# EAGLE design MRCS-Optical-Detector (EAGLE 7.7.0)
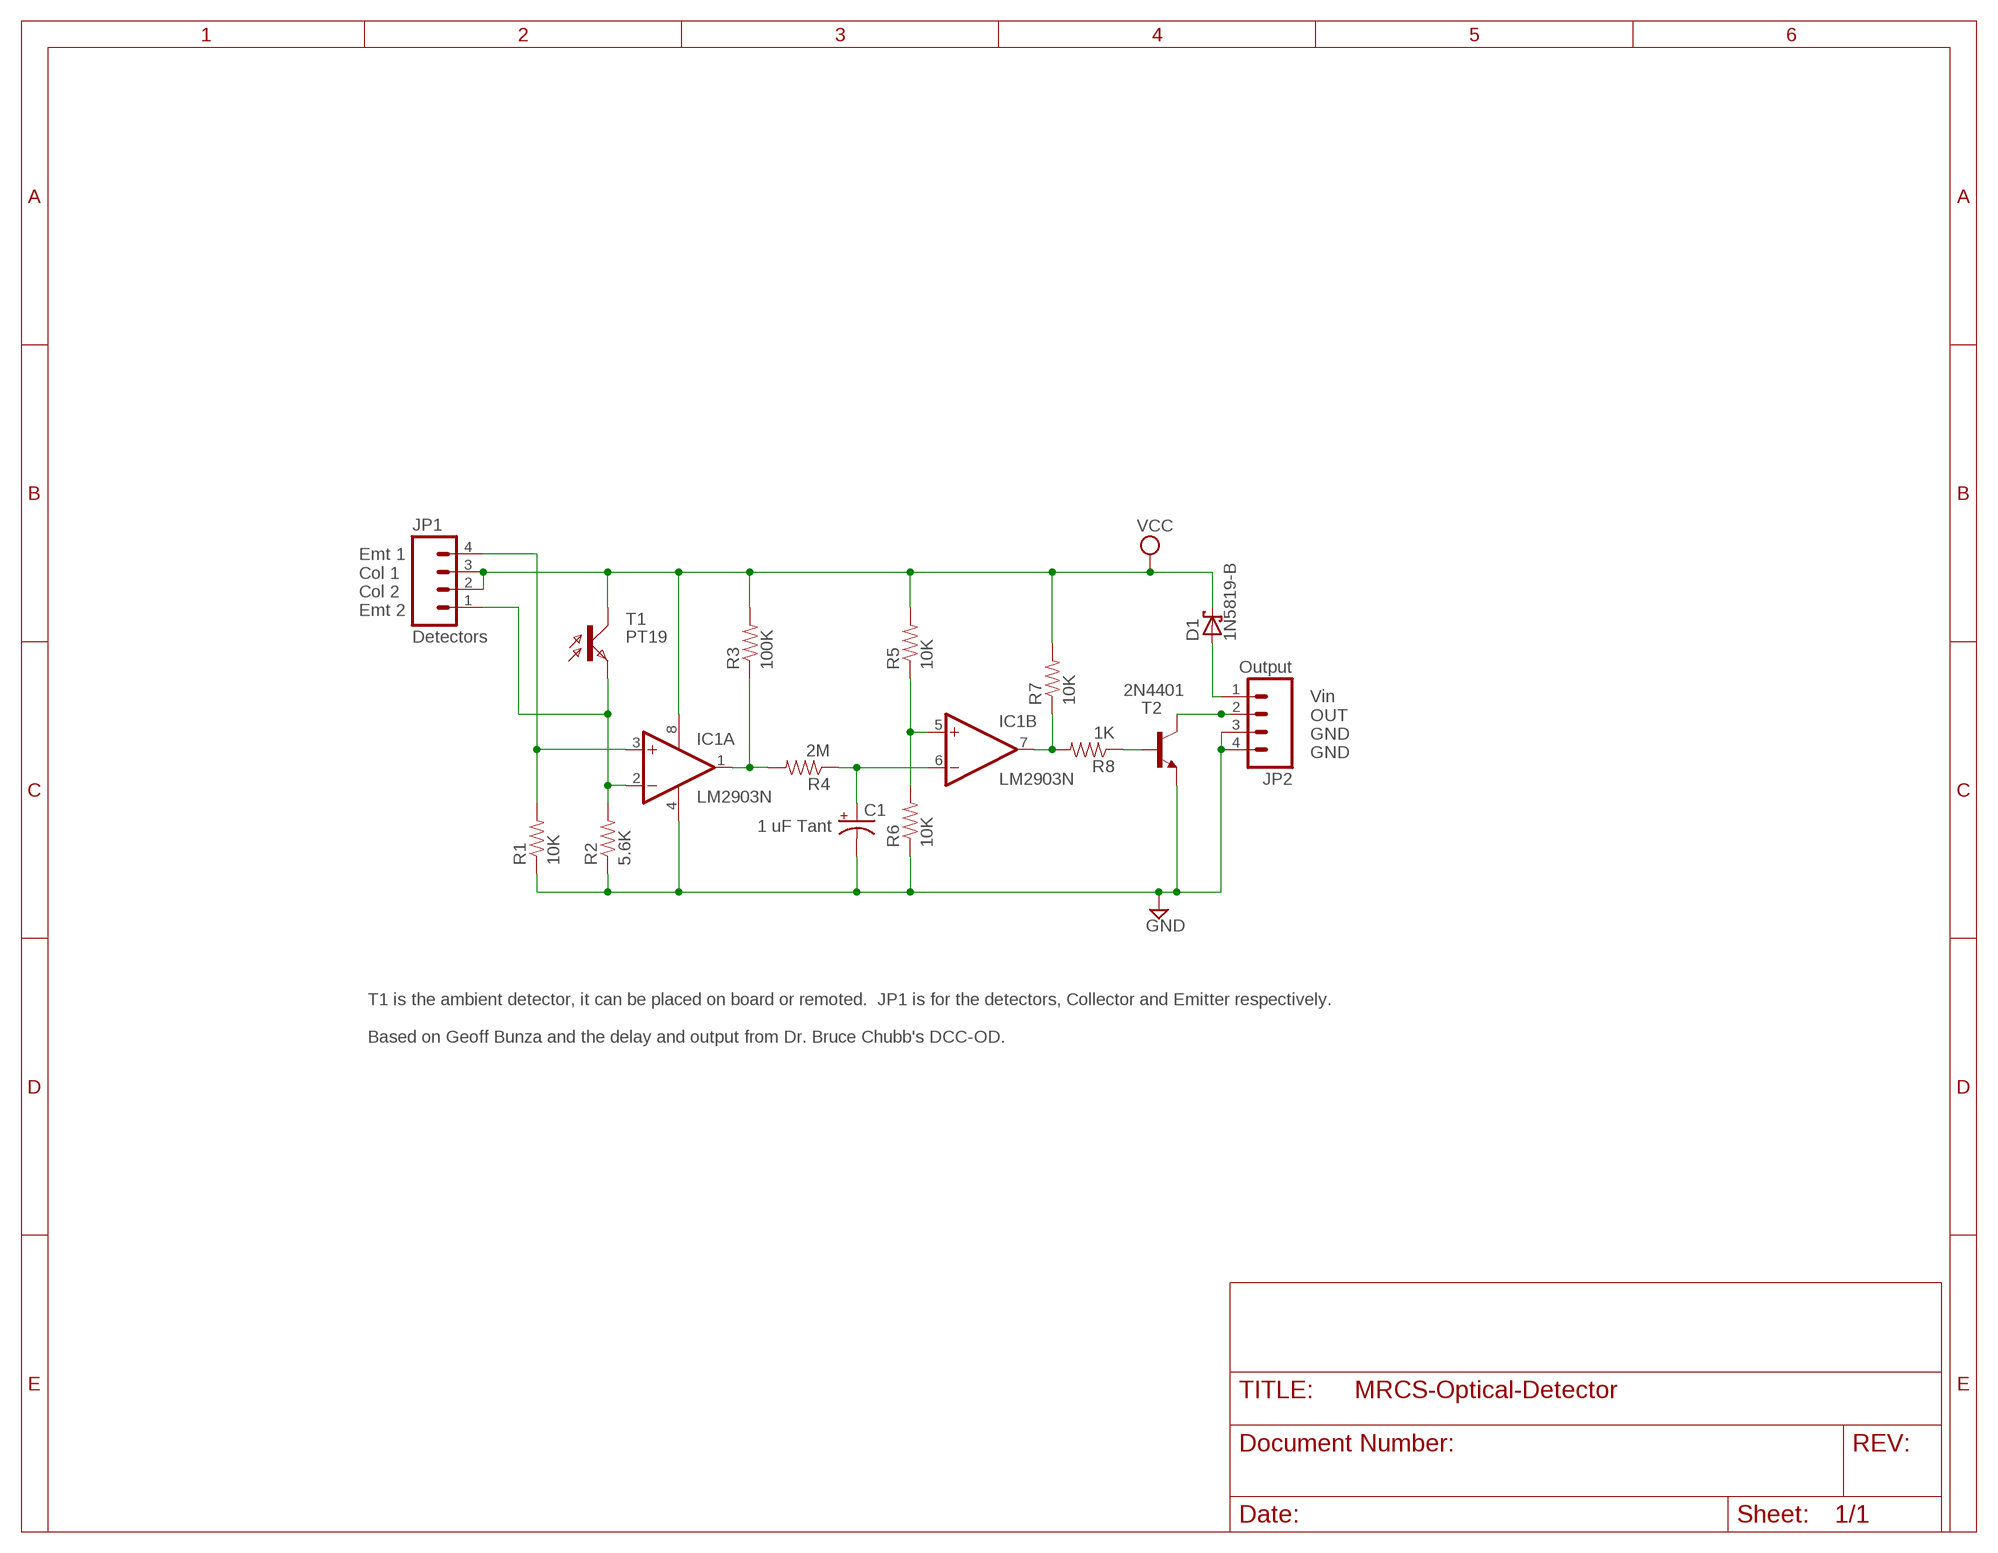
[diagram p0: schematic, sheet 1]

## Parts
C1  1 uF Tant  CPOL-USE2.5-5  [E2.5-5]
D1  1N5819-B  [DO41-7.6]
IC1  LM2903N  [DIL08]
JP1  Detectors  M04LOCK  [1X04_LOCK]
JP2  Output  M04LOCK  [1X04_LOCK]
R1  10K  RESISTORPTH-1/4W  [AXIAL-0.4]
R2  5.6K  RESISTORPTH-1/4W  [AXIAL-0.4]
R3  100K  RESISTORPTH-1/4W  [AXIAL-0.4]
R4  2M  RESISTORPTH-1/4W  [AXIAL-0.4]
R5  10K  RESISTORPTH-1/4W  [AXIAL-0.4]
R6  10K  RESISTORPTH-1/4W  [AXIAL-0.4]
R7  10K  RESISTORPTH-1/4W  [AXIAL-0.4]
R8  1K  RESISTORPTH-1/4W  [AXIAL-0.4]
T1  PT19  BPX81  [BPX81]
T2  2N4401  2N3904-NPN-TO92-EBC  [TO92-EBC]

## Nets
GND: C1.- IC1.4(P:V-) JP2.3 JP2.4 R1.P$1 R2.P$1 R6.P$1 T2.E
N$1: IC1.2(A:-IN) JP1.1 R2.P$2 T1.E
N$2: C1.+ IC1.6(B:-IN) R4.P$1
N$3: IC1.3(A:+IN) JP1.4 R1.P$2
N$4: IC1.1(A:OUT) R3.P$1 R4.P$2
N$5: IC1.7(B:OUT) R7.P$1 R8.P$2
N$6: IC1.5(B:+IN) R5.P$1 R6.P$2
N$7: R8.P$1 T2.B
N$8: JP2.2 T2.C
VCC: D1.C IC1.8(P:V+) JP1.2 JP1.3 R3.P$2 R5.P$2 R7.P$2 T1.C
VIN: D1.A JP2.1

## Notes on the sheet
- Emt 1
  Col 1
  Col 2
  Emt 2
- Vin
  OUT
  GND
  GND
- T1 is the ambient detector, it can be placed on board or remoted.  JP1 is for the detectors, Collector and Emitter respectively.
  
  Based on Geoff Bunza and the delay and output from Dr. Bruce Chubb's DCC-OD.

## Library data of the parts
C1 = rcl:CPOL-US: POLARIZED CAPACITOR, American symbol
D1 = diode:1N581*: 1.0A SCHOTTKY BARRIER RECTIFIER Source: http://www.diodes.com/datasheets/ds23001.pdf
IC1 = linear:LM2903: COMPARATOR
JP1 JP2 = SparkFun-Connectors:M04: Header 4 Standard 4-pin 0.1" header. Use with straight break away headers (SKU : PRT-00116), right angle break away headers (PRT-00553), swiss pins (PRT-00743), machine pins (PRT-00117), and female headers (PRT-00115). Molex polarized connector foot print use with SKU : PRT-08231 with associated crimp pins and housings. 1MM SMD Version SKU: PRT-10208
R1-R8 = SparkFun-Resistors:RESISTOR: Resistor Basic schematic elements and footprints for 0603, 1206, and PTH resistors.
T1 = opto-trans-siemens:BPX81: PHOTO TRANSISTOR; OC_FARNELL: unknown; OC_NEWARK: unknown
T2 = transistor-neu-to92:*-NPN-: NPN Transistror

## Board
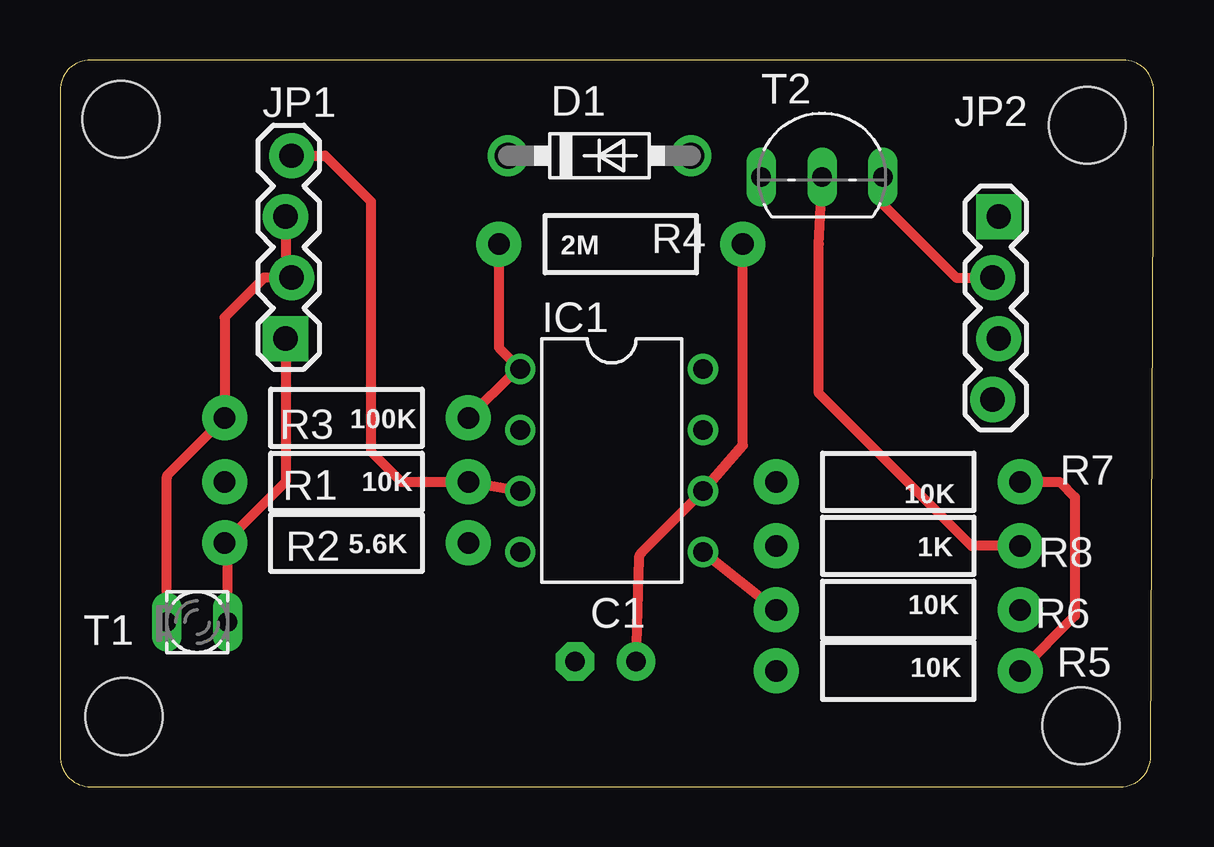
[diagram p1: board, top side]
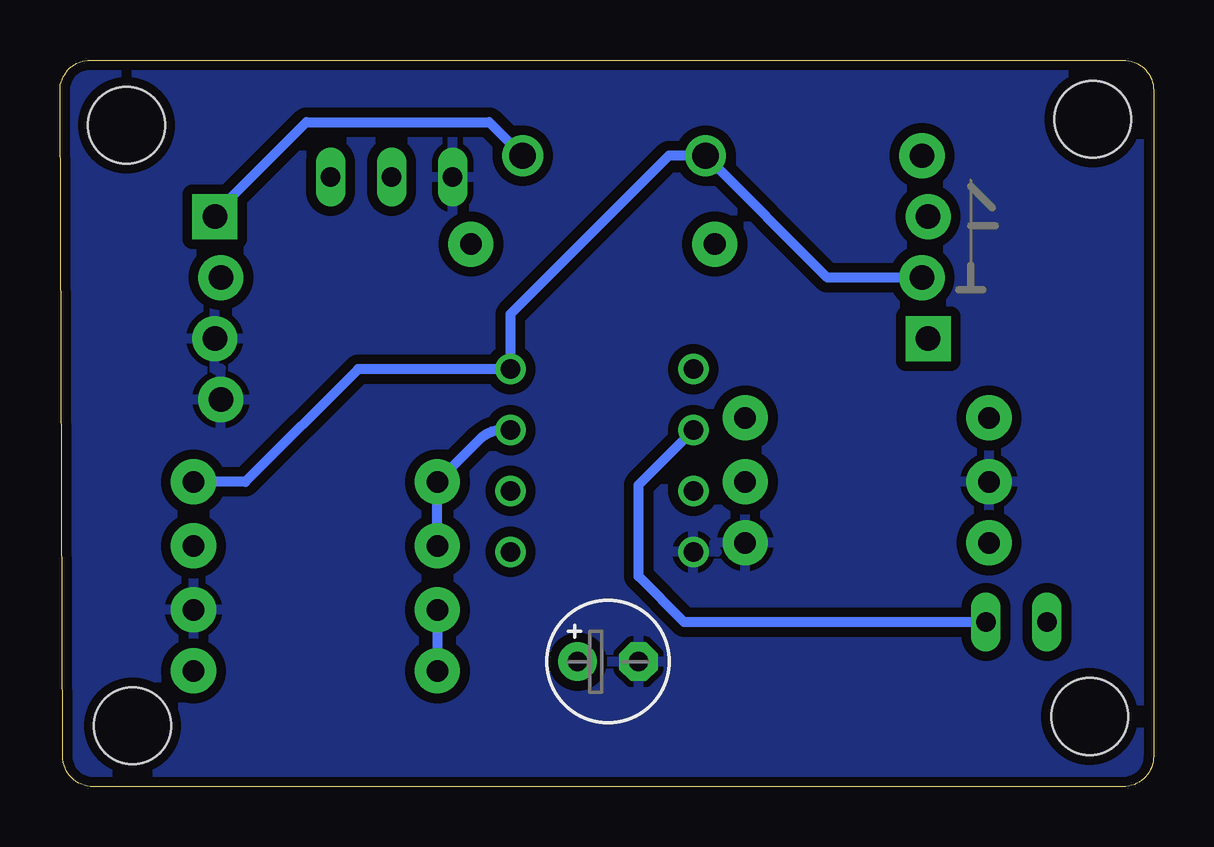
[diagram p2: board, bottom side, seen from below]

Size 45.57 x 30.28 mm. Coordinates in mm from the lower left corner, seen from the top.
Outline: 0,29.01 0,1.27 arc90 1.27,0 44.18,0 arc90 45.45,1.27 45.57,29 arc90 44.3,30.28 1.27,30.28 arc90 0,29.01
Copper layers (1*16): Top 0.0356mm / dielectric 1.5011mm / Bottom 0.0356mm
Design rules "LaenPCBOrder": minimum track width 6mil, minimum drill 13mil, track to track 6mil, track to pad 6mil, pad to pad 6mil, via to via 6mil, smd to smd 6mil, copper to edge 15mil, drill to drill 6mil, minimum pad ring 7mil, minimum via ring 7mil, stop-mask expansion 4mil, vias tented up to drill 0mil, thermal gap 10mil
Holes 3.2 mm at 2.54,27.81 42.8,27.56 2.67,2.92 42.54,2.54

### Footprints (pad centres in the part's own frame; a part is rotated, then mirrored left to right if it is on the bottom)
E2.5-5 = drill 0.813 pad 1.6: + -1.27,0 | drill 0.813 pad 1.6 octagon: - 1.27,0
DO41-7.6 = drill 1.1 pad 1.7: A 3.81,0; C -3.81,0
DIL08 = drill 0.813 pad 1.27: 1 -3.81,-3.81; 2 -1.27,-3.81; 3 1.27,-3.81; 4 3.81,-3.81; 5 3.81,3.81; 6 1.27,3.81; 7 -1.27,3.81; 8 -3.81,3.81
1X04_LOCK = drill 1.016 pad 1.88 square: 1 0,0.127 | drill 1.016 pad 1.88: 2 2.54,-0.127; 3 5.08,0.127; 4 7.62,-0.127
AXIAL-0.4 = drill 0.9 pad 1.88: P$1 -5.08,0; P$2 5.08,0
BPX81 = drill 0.813 long: C 1.27,0; E -1.27,0
TO92-EBC = drill 0.813 long: B 0,-1.27; C 2.54,-1.27; E -2.54,-1.27

### Placement (x,y rotation side)
C1  22.73,5.21 0 bottom
D1  22.48,26.29 0 top
IC1  22.99,13.59 270 top
JP1  9.52,18.67 90 top
JP2  38.99,23.75 270 top
R1  11.94,12.7 0 top
R2  11.94,10.16 180 top
R3  11.94,15.37 180 top
R4  23.37,22.61 180 top
R5  34.92,4.83 0 top
R6  34.92,7.37 180 top
R7  34.92,12.7 0 top
R8  34.92,10.03 180 top
T1  5.71,6.86 180 top
T2  31.75,26.67 0 top
U$1  [MRCSLOGOBTM]  1.27,20.19 0 top
U$3  [CA-PROP65WARNING]  34.92,18.03 90 top

### Tracks (layer width: path | path; a pad name or v marks a point on that pad's centre or on a via)
GND
  pour Bottom (isolate 0.406): 0.38,29.97 45.21,29.97 44.96,0.51 0.51,0.51
N$1
  Top 0.406: JP1.1 9.4,12.7 R2.P$2 6.99,10.03 T1.E
  Bottom 0.406: T1.E 19.56,6.86 21.46,8.76 21.46,12.57 IC1.2
N$2
  Top 0.406: R4.P$1 28.45,14.22 IC1.6 24.22,9.74 arc45 24.13,9.52 C1.+
N$3
  Top 0.406: JP1.4 11.05,26.29 12.95,24.38 12.95,13.97 14.22,12.7 R1.P$2 IC1.3
N$4
  Top 0.406: R4.P$2 18.29,18.29 IC1.1 arc45 18.96,17.31 R3.P$1
N$5
  Bottom 0.406: R8.P$2 R7.P$1 28.06,14.49 arc45 27.16,14.86 IC1.7
N$6
  Top 0.406: IC1.5 R6.P$2
  Bottom 0.406: R6.P$2 R5.P$1
N$7
  Top 0.406: R8.P$1 37.97,10.03 31.62,16.38 31.62,22.61 T2.B
N$8
  Top 0.406: T2.C 34.29,24.26 37.34,21.21 JP2.2
VCC
  Top 0.406: T1.C 4.45,12.83 arc-45 4.54,13.04 R3.P$2 6.86,19.56 8.51,21.21 JP1.2 9.4,21.46 JP1.3 | R7.P$2 41.66,12.7 42.29,12.06 42.29,7.11 R5.P$2
  Bottom 0.406: JP1.2 13.59,21.21 D1.C 20.19,26.29 26.8,19.68 IC1.8 33.15,17.4 37.85,12.7 R7.P$2
VIN
  Bottom 0.406: JP2.1 39.12,23.88 35.31,27.69 27.69,27.69 D1.A

### Text on the board
tDocu: E1 / C1 / C2 / E2 | Vin / OUT / GND / GND | EOPD Geoff Bunza 2015, Seth Neumann 2017
bDocu: MRCS EDAPD-DFM / Based on Geoff Bunza 2015 | rev 2 20171211